# Altium schematic sheet SD.SchDoc: =VariantName
size 274 x 177 mm; SheetNumber: 2; SheetTotal: 7
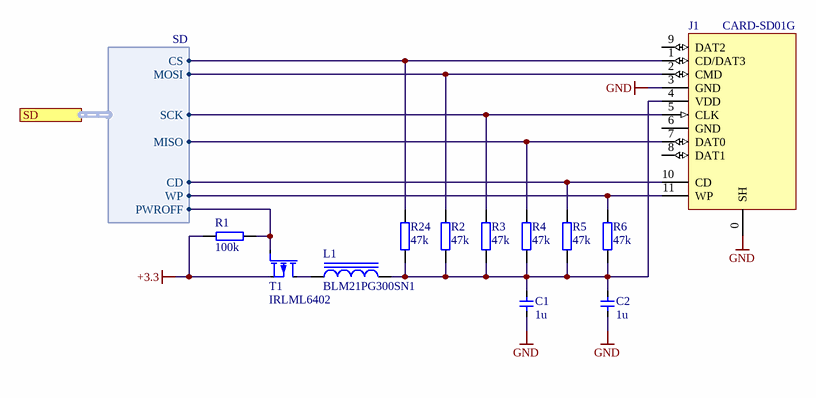
[diagram p0: SD.SchDoc]

## Parts
C1  1u  [C0805]
C2  1u  [C0805]
J1  CARD-SD01G  [CARD-SD01G]
L1  BLM21PG300SN1  [L0805]
R1  100k  [R0805]
R2  47k  [R0805]
R3  47k  [R0805]
R4  47k  [R0805]
R5  47k  [R0805]
R6  47k  [R0805]
R24  47k  [R0805]
T1  IRLML6402  [MICRO3]

## Ports
SD (harness SD)

## Harnesses
SD: PWROFF, CD, WP, CS, MOSI, MISO, SCK

## Nets
+3.3: R1.2 T1.S
GND: C1.1 C2.1 J1.0(SH) J1.3(GND)
NetC1_2: C1.2 C2.2 J1.4(VDD) L1.2 R2.1 R3.1 R4.1 R5.1 R6.1 R24.1
NetJ1_1: J1.1(CD/DAT3) R24.2 ; port SD.CS
NetJ1_2: J1.2(CMD) R2.2 ; port SD.MOSI
NetJ1_5: J1.5(CLK) R3.2 ; port SD.SCK
NetJ1_7: J1.7(DAT0) R4.2 ; port SD.MISO
NetJ1_10: J1.10(CD) R5.2 ; port SD.CD
NetJ1_11: J1.11(WP) R6.2 ; port SD.WP
NetL1_1: L1.1 T1.D
NetR1_1: R1.1 T1.G ; port SD.PWROFF

Not connected (* = marked no-connect by the designer): J1 6(GND) 8(DAT1) 9(DAT2)

## Notes on the sheet
- Name:
- Device:
- File:

## Library data of the parts
C1 C2 = C: C; capacitor; Value: 1u; P&P: *
J1 = SD: SD Card Socket, push-pull; ID: 631; Order Code: CARD-SD01G-LF; Part No: CARD-SD01G; Supplier: Maritex
L1 = BLM21PG300SN1: L;; Indeks: MIDSD062; P&P: 1; Value: BLM21PG300SN1
R1-R6 R24 = R: R; resistor; Indeks: *; P&P: *
  R1: Value: 100k
  R2-R6 R24: Value: 47k
T1 = IRLML6402: T_M_P; P-Channel MOSFET; Indeks: MTRSP030; P&P: 1; Value: IRLML6402